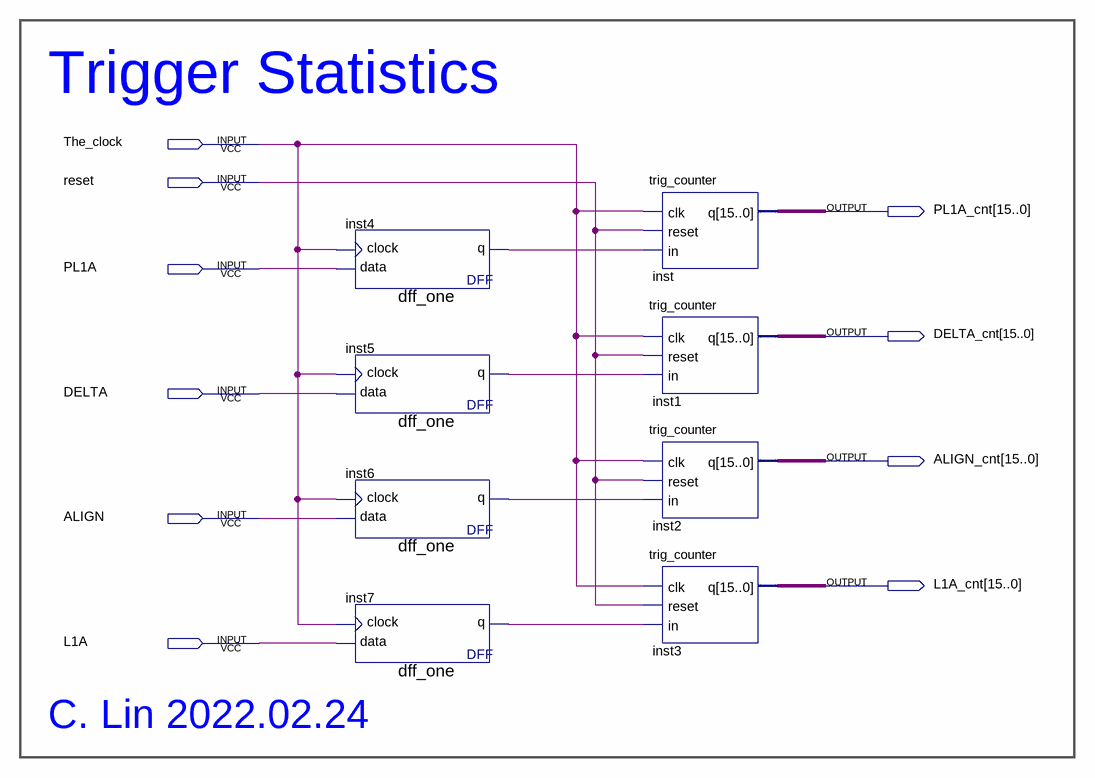
[diagram p0: schematic sheet]
// Quartus schematic trig_statistics.bdf as structural Verilog: 8 symbols, 10 pins
module trig_statistics (
  input  The_clock,
  input  reset,
  input  PL1A,
  input  DELTA,
  input  ALIGN,
  input  L1A,
  output [15:0] PL1A_cnt,
  output [15:0] DELTA_cnt,
  output [15:0] ALIGN_cnt,
  output [15:0] L1A_cnt
);

  wire inst4_q, inst5_q, inst6_q, inst7_q;

  dff_one inst4 (.data(PL1A), .clock(The_clock), .q(inst4_q));
  dff_one inst5 (.data(DELTA), .clock(The_clock), .q(inst5_q));
  dff_one inst6 (.data(ALIGN), .clock(The_clock), .q(inst6_q));
  dff_one inst7 (.data(L1A), .clock(The_clock), .q(inst7_q));
  trig_counter inst (.clk(The_clock), .reset(reset), .in(inst4_q), .q(PL1A_cnt));
  trig_counter inst1 (.clk(The_clock), .reset(reset), .in(inst5_q), .q(DELTA_cnt));
  trig_counter inst2 (.clk(The_clock), .reset(reset), .in(inst6_q), .q(ALIGN_cnt));
  trig_counter inst3 (.clk(The_clock), .reset(reset), .in(inst7_q), .q(L1A_cnt));

  // Notes on the sheet:
  //   Trigger Statistics
  //   C. Lin 2022.02.24
endmodule
